# EAGLE design MAX30105_Breakout (EAGLE 7.5.0)
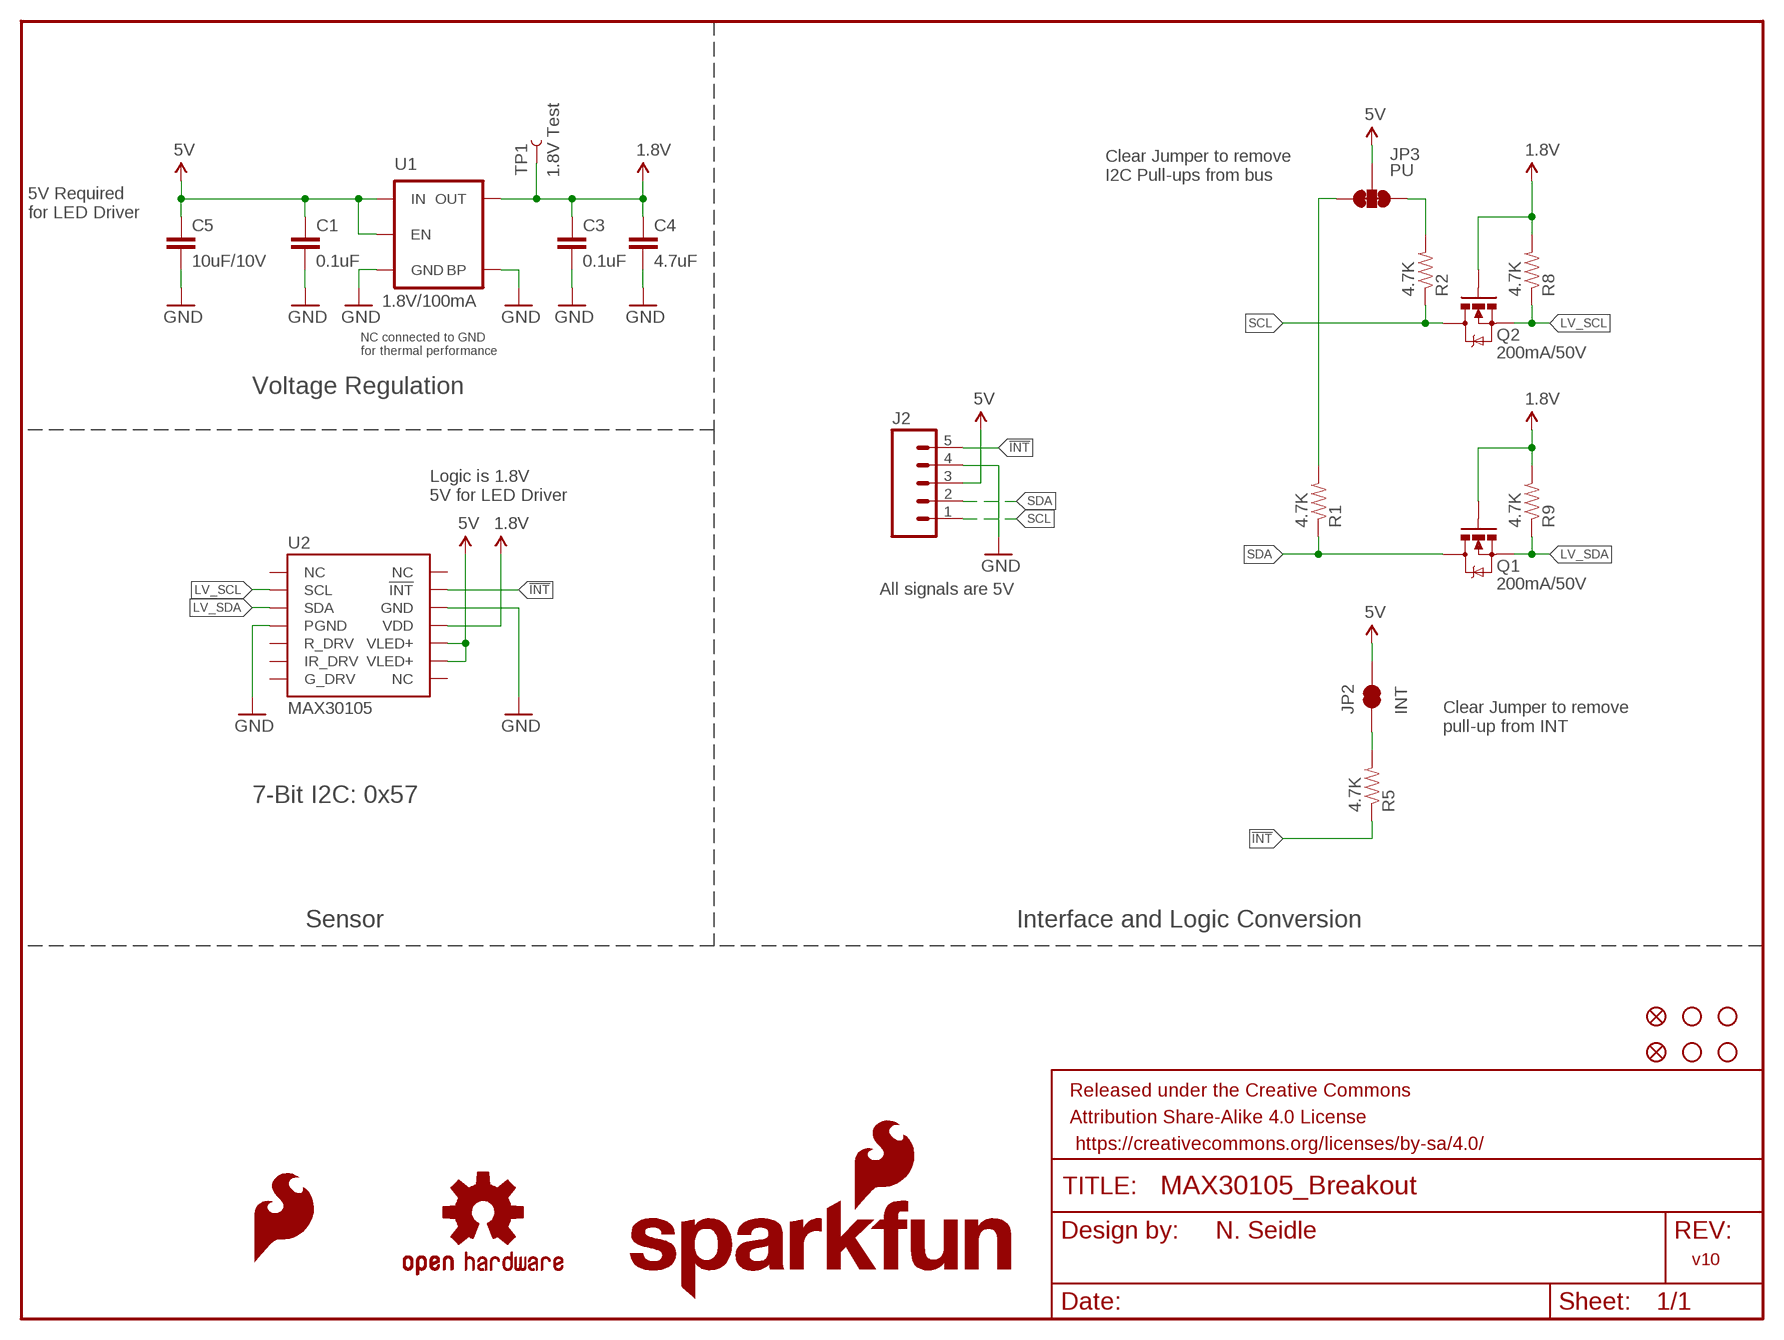
[diagram p0: schematic, sheet 1]

## Parts
C1  0.1uF  0.1UF-25V(+80/-20%)(0603)  [0603-CAP]
C3  0.1uF  0.1UF-25V(+80/-20%)(0603)  [0603-CAP]
C4  4.7uF  4.7UF-6.3V-10%(0603)0603  [0603-CAP]
C5  10uF/10V  10UF10V10%(0805)  [0805-CAP]
FID1  FIDUCIAL1X2  [FIDUCIAL-1X2]
FID2  FIDUCIAL1X2  [FIDUCIAL-1X2]
FRAME1  FRAME-LETTER  [CREATIVE_COMMONS]
J2  M05PTH  [1X05]
JP2  INT  JUMPER-PAD-2-NC_BY_TRACE  [PAD-JUMPER-2-NC_BY_TRACE_YES_SILK]
JP3  PU  JUMPER-PAD-3-NC_BY_TRACE  [PAD-JUMPER-3-3OF3_NC_BY_TRACE_YES_SILK_FULL_BOX]
LOGO1  SFE_LOGO_NAME_FLAME.1_INCH  [SFE_LOGO_NAME_FLAME_.1]
LOGO2  OSHW-LOGOS  [OSHW-LOGO-S]
LOGO4  SFE_LOGO_FLAME.1EXP  [SFE_LOGO_FLAME_COPPER_EXPOSED_.1]
Q1  200mA/50V  MOSFET-NCHANNELBSS138  [SOT23-3]
Q2  200mA/50V  MOSFET-NCHANNELBSS138  [SOT23-3]
R1  4.7K  4.7KOHM-1/10W-1%(0603)  [0603-RES]
R2  4.7K  4.7KOHM-1/10W-1%(0603)  [0603-RES]
R5  4.7K  4.7KOHM-1/10W-1%(0603)  [0603-RES]
R8  4.7K  4.7KOHM-1/10W-1%(0603)  [0603-RES]
R9  4.7K  4.7KOHM-1/10W-1%(0603)  [0603-RES]
STANDOFF1  STAND-OFF  [STAND-OFF]
STANDOFF2  STAND-OFF  [STAND-OFF]
STANDOFF3  STAND-OFF  [STAND-OFF]
STANDOFF4  STAND-OFF  [STAND-OFF]
TP1  1.8V Test  TEST-POINT3X4  [PAD.03X.04]
U1  1.8V/100mA  V_REG_SP62141.8V  [SC70]
U2  MAX30105  MAX30105SMD  [OLGA-14]

## Nets
1.8V: C3.1 C4.1 Q1.1(G) Q2.1(G) R8.2 R9.2 TP1.P$1 U1.5(OUT) U2.11(VDD)
5V: C1.1 C5.1 J2.3 JP2.2 JP3.2 U1.1(IN) U1.3(EN) U2.9(VLED+) U2.10(VLED+)
!INT: J2.5 R5.1 U2.13(!INT)
GND [power]: C1.2 C3.2 C4.2 C5.2 J2.4 U1.2(GND) U1.4(BP) U2.4(PGND) U2.12(GND)
LV_SCL: Q2.2(S) R8.1 U2.2(SCL)
LV_SDA: Q1.2(S) R9.1 U2.3(SDA)
N$1: JP2.1 R5.2
N$2: JP3.1 R2.2
N$3: JP3.3 R1.2
SCL: J2.1 Q2.3(D) R2.1
SDA: J2.2 Q1.3(D) R1.1
Unconnected: U2.1(NC) U2.5(R_DRV) U2.6(IR_DRV) U2.7(G_DRV) U2.8(NC) U2.14(NC)

## Notes on the sheet
- Clear Jumper to remove 
  I2C Pull-ups from bus
- 5V Required
  for LED Driver
- NC connected to GND
  for thermal performance
- Voltage Regulation
- Logic is 1.8V
  5V for LED Driver
- All signals are 5V
- Clear Jumper to remove 
  pull-up from INT
- 7-Bit I2C: 0x57
- Sensor | Interface and Logic Conversion
- N. Seidle
- v10

## Library data of the parts
C1 C3 = SparkFun-Capacitors:0.1UF-25V(+80/-20%)(0603): CAP-00810 Ceramic Standard decoupling cap; PROD_ID: CAP-00810
C4 = SparkFun-Capacitors:4.7UF-6.3V-10%(0603): CAP-08280; PROD_ID: CAP-08280
C5 = SparkFun-Capacitors:10UF10V10%(0805): CAP-11330; PROD_ID: CAP-11330
FID1 FID2 = SparkFun-Aesthetics:FIDUCIAL: Fiducial Alignment Points Various fiducial points for machine vision alignment.
FRAME1 = SparkFun-Aesthetics:FRAME-LETTER: Schematic Frame Standard 8.5x11 US Letter frame
J2 = SparkFun-Connectors:M05: Header 5 Standard 5-pin 0.1" header. Use with straight break away headers (SKU : PRT-00116), right angle break away headers (PRT-00553), swiss pins (PRT-00743), machine pins (PRT-00117), and female headers (PRT-00115). Molex polarized connector foot print use with SKU : PRT-08230 with associated crimp pins and housings.
JP2 = SparkFun-Passives:JUMPER-PAD-2-NC_BY_TRACE
JP3 = SparkFun-Passives:JUMPER-PAD-3-NC_BY_TRACE
LOGO1 = SparkFun-Aesthetics:SFE_LOGO_NAME_FLAME: SFE Logo, name and flame This is the SparkFun full logo. The logo on the schematic will always be the same size; the package variant is the height of the flame part of the logo. Default layer for the logo on the board is tSilk.
LOGO2 = SparkFun-Aesthetics:OSHW-LOGO: Open Source Hardware Logo This logo indicates the piece of hardware it is found on incorporates a OSHW license and/or adheres to the definition of open source hardware found here: http://freedomdefined.org/OSHW
LOGO4 = SparkFun-Aesthetics:SFE_LOGO_FLAME: SFE Logo, flame only This is the SparkFun flame logo. The logo on the schematic will always be the same size; the package variant is the height of the flame. Default layer for the logo on the board is tSilk.
Q1 Q2 = SparkFun-DiscreteSemi:MOSFET-NCHANNEL: Common NMOSFET Parts MFG P/N Store ID Prod ID FDD8780 TRANS-09984 SI7820DN TRANS-11055 FDS6630A IC-08089 2N7002PW TRANS-11151 FQP30N06L COM-10213 TRANS-10060 BSS123LT1G TRANS-08345 BSS138 TRANS-00830 BS170 2N7000; PROD_ID: TRANS-00830
R1 R2 R5 R8 R9 = SparkFun-Resistors:4.7KOHM-1/10W-1%(0603): RES-07857; PROD_ID: RES-07857
STANDOFF1-STANDOFF4 = SparkFun-Electromechanical:STAND-OFF: #4 Stand Off This is the mechanical footprint for a #4 phillips button head screw. Use the keepout ring to avoid running the screw head into surrounding components. SKU : PRT-00447
TP1 = SparkFun-Passives:TEST-POINT: Bare copper test points for troubleshooting or ICT
U1 = SparkFun-PowerIC:V_REG_SP6214; PROD_ID: VREG-08428
U2 = SparkFun-Sensors:MAX30105: Description: Particle Detection IC. Primarily used for smoke detection, can be used for Pulse Detection, Pulse Ox, and possible visual particle detection.; PROD_ID: IC-13510

## Net classes
1 power: width 0.203 mm

## Board
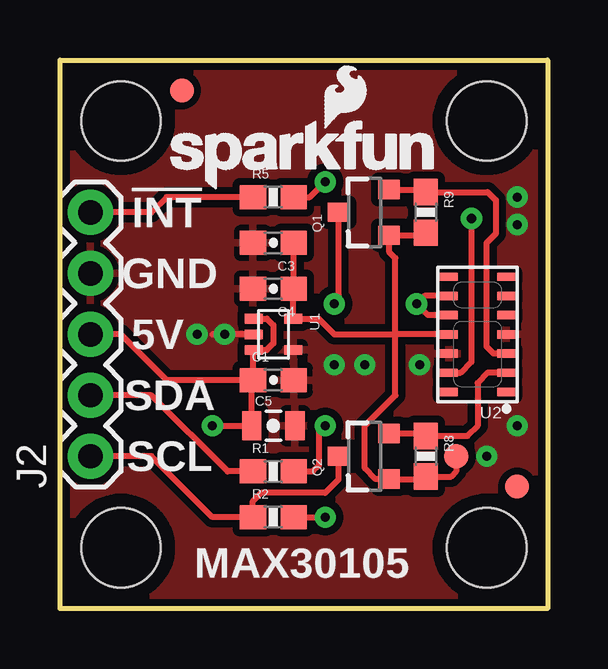
[diagram p1: board, top side]
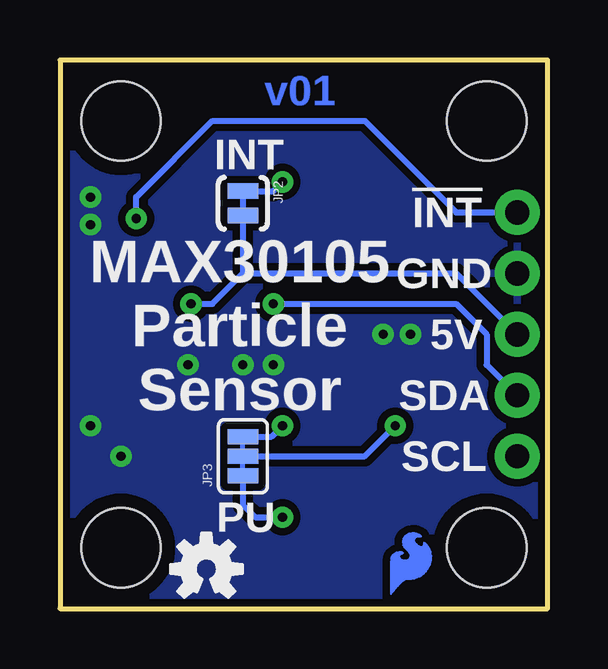
[diagram p2: board, bottom side, seen from below]

Size 20.32 x 22.86 mm. Coordinates in mm from the lower left corner, seen from the top.
Outline: 20.32,0 0,0 0,22.86 20.32,22.86 20.32,0
Copper layers (1*16): Top 0.035mm / dielectric 1.5mm / Bottom 0.035mm
Design rules "SparkFun-2-layer-STANDARD *": minimum track width 10mil, minimum drill 15mil, track to track 10mil, track to pad 8mil, pad to pad 8mil, via to via 10mil, smd to smd 8mil, copper to edge 8mil, drill to drill 8mil, minimum pad ring 10mil, minimum via ring 10mil, stop-mask expansion 4mil, vias tented up to drill 20mil, thermal gap 10mil

### Footprints (pad centres in the part's own frame; a part is rotated, then mirrored left to right if it is on the bottom)
0603-CAP = smd 1.1 x 1: 1 -0.85,0; 2 0.85,0
0805-CAP = smd 0.8 x 1.2: 1 -0.9,0; 2 0.9,0
FIDUCIAL-1X2 = smd 1 x 1: 1 0,0
1X05 = drill 1.016 pad 1.88: 1 0,0; 2 2.54,0; 3 5.08,0; 4 7.62,0; 5 10.16,0
PAD-JUMPER-2-NC_BY_TRACE_YES_SILK = smd 0.635 x 1.27: 1 -0.508,0; 2 0.508,0
PAD-JUMPER-3-3OF3_NC_BY_TRACE_YES_SILK_FULL_BOX = smd 0.635 x 1.27: 1 -0.813,0; 2 0,0; 3 0.813,0
SOT23-3 = smd 0.8 x 0.9: 1 -0.95,-1; 2 0.95,-1; 3 0,1.1
0603-RES = smd 1.1 x 1: 1 -0.85,0; 2 0.85,0
STAND-OFF = hole 3.302: 0,0
PAD.03X.04 = smd 1.016 x 1.016: P$1 0,0
SC70 = smd 0.4 x 0.75: 1 -0.65,-0.825; 2 0,-0.825; 3 0.65,-0.825; 4 0.65,0.825; 5 -0.65,0.825
OLGA-14 = smd 0.75 x 0.35: 1 -1.2,2.4; 2 -1.2,1.6; 3 -1.2,0.8; 4 -1.2,0; 5 -1.2,-0.8; 6 -1.2,-1.6; 7 -1.2,-2.4; 8 1.2,-2.4; 9 1.2,-1.6; 10 1.2,-0.8; 11 1.2,0; 12 1.2,0.8; 13 1.2,1.6; 14 1.2,2.4

### Placement (x,y rotation side)
C1  8.89,9.53 0 top
C3  8.89,15.24 180 top
C4  8.89,13.34 180 top
C5  8.89,7.62 0 top
FID1  19.05,5.08 0 top
FID2  5.08,21.59 0 top
FRAME1  -2.54,-16.51 0 top  (outside the outline)
J2  1.27,6.35 90 top
JP2  12.7,16.89 270 bottom
JP3  12.7,6.35 90 bottom
LOGO1  4.19,17.4 0 top
LOGO2  14.22,1.65 0 bottom
LOGO4  6.86,0.25 0 bottom
Q1  12.7,16.51 90 top
Q2  12.7,6.35 90 top
R1  8.89,5.71 0 top
R2  8.89,3.81 0 top
R5  8.89,17.14 0 top
R8  15.24,6.35 270 top
R9  15.24,16.51 270 top
STANDOFF1  17.78,20.32 0 top
STANDOFF2  17.78,2.54 0 top
STANDOFF3  2.54,2.54 0 top
STANDOFF4  2.54,20.32 0 top
TP1  16.51,6.35 0 top
U1  8.89,11.43 270 top
U2  17.4,11.43 180 top

### Tracks (layer width: path | path; a pad name or v marks a point on that pad's centre or on a via)
1.8V
  Top 0.254: C3.1 C4.1 9.71,13.31 U1.5 10.78,12.08 11.43,11.43 13.97,11.43 | R9.2 15.14,15.56 Q1.1 13.7,14.88 13.97,14.61 13.97,11.43 | 13.97,11.43 13.97,8.89 12.7,7.62 12.7,5.84 13.14,5.4 Q2.1 15.14,5.4 R8.2 16.3,5.5 16.51,5.71 TP1.P$1 | U2.11 13.97,11.43
5V  (via drill 0.38)
  Top 0.254: U2.10 15.33,12.23 v14.86,12.7 15.19,13.03 U2.9 | U1.1 8.62,12.08 8.89,11.81 8.89,11.05 8.62,10.78 U1.3 8.04,10.76 C1.1 | v6.35,7.62 C5.1 7.99,9.47 C1.1 | C1.1 4.45,9.53 2.54,11.43 J2.3
  Bottom 0.254: 12.7,13.97 3.81,13.97 J2.3 | JP2.2 12.7,13.97 | v14.86,12.7 13.97,12.7 12.7,13.97 | JP3.2 7.62,6.35 v6.35,7.62
!INT  (via drill 0.38)
  Top 0.254: R5.1 4.45,17.14 3.81,16.51 J2.5 | U2.13 16.69,9.83 17.14,10.29 v17.14,16.26
  Bottom 0.254: v17.14,16.26 17.14,17.14 13.97,20.32 7.62,20.32 3.81,16.51 J2.5
GND  (via drill 0.38)
  Top 0.254: U1.2 6.35,11.43
  other vias: 12.7,10.16 14.99,10.16 19.05,7.62 6.86,11.43 19.05,17.14 11.43,10.16 5.71,11.43 19.05,16 17.78,6.35
  pour Top (isolate 0.305, rank 6): 20.32,22.86 0,22.86 0,0 20.32,0
  pour Bottom (isolate 0.305, rank 6): 20.32,22.86 0,22.86 0,0 20.32,0
LV_SCL
  Top 0.254: Q2.2 15.14,7.3 R8.1 16.98,7.2 17.4,7.62 17.4,9.4 17.83,9.83 U2.2
LV_SDA
  Top 0.254: Q1.2 15.14,17.46 R9.1 17.82,17.36 18.16,17.02 18.16,15.62 17.78,15.24 17.78,10.92 18.07,10.63 U2.3
N$1  (via drill 0.38)
  Top 0.254: R5.2 10.41,17.14 v11.05,17.78
  Bottom 0.254: JP2.1 11.43,17.4 v11.05,17.78
N$2  (via drill 0.38)
  Top 0.254: R2.2 v11.05,3.81
  Bottom 0.254: JP3.1 12.7,4.32 12.19,3.81 v11.05,3.81
N$3  (via drill 0.38)
  Top 0.254: R1.2 10.54,5.71 10.79,5.97 10.79,7.37 v11.05,7.62
  Bottom 0.254: JP3.3 11.51,7.16 v11.05,7.62
SCL
  Top 0.254: J2.1 3.81,6.35 6.35,3.81 R2.1 8.04,4.48 8.38,4.83 11.05,4.83 11.6,5.38 Q2.3
SDA  (via drill 0.38)
  Top 0.254: Q1.3 11.6,12.87 v11.43,12.7 | R1.1 6.99,5.71 3.81,8.89 J2.2
  Bottom 0.254: v11.43,12.7 3.81,12.7 2.54,11.43 2.54,10.16 J2.2

### Text on the board
Bottom: v01
tPlace: !INT | GND | 5V | SDA | SCL | MAX30105
bPlace: INT | !INT | GND | MAX30105 / Particle / Sensor | 5V | SDA | SCL | PU
Measures: Clears 4-40 Screw | All Dimensions in Inches
tDocu: N. Seidle